# Altium project omni robot main board.PrjPcb
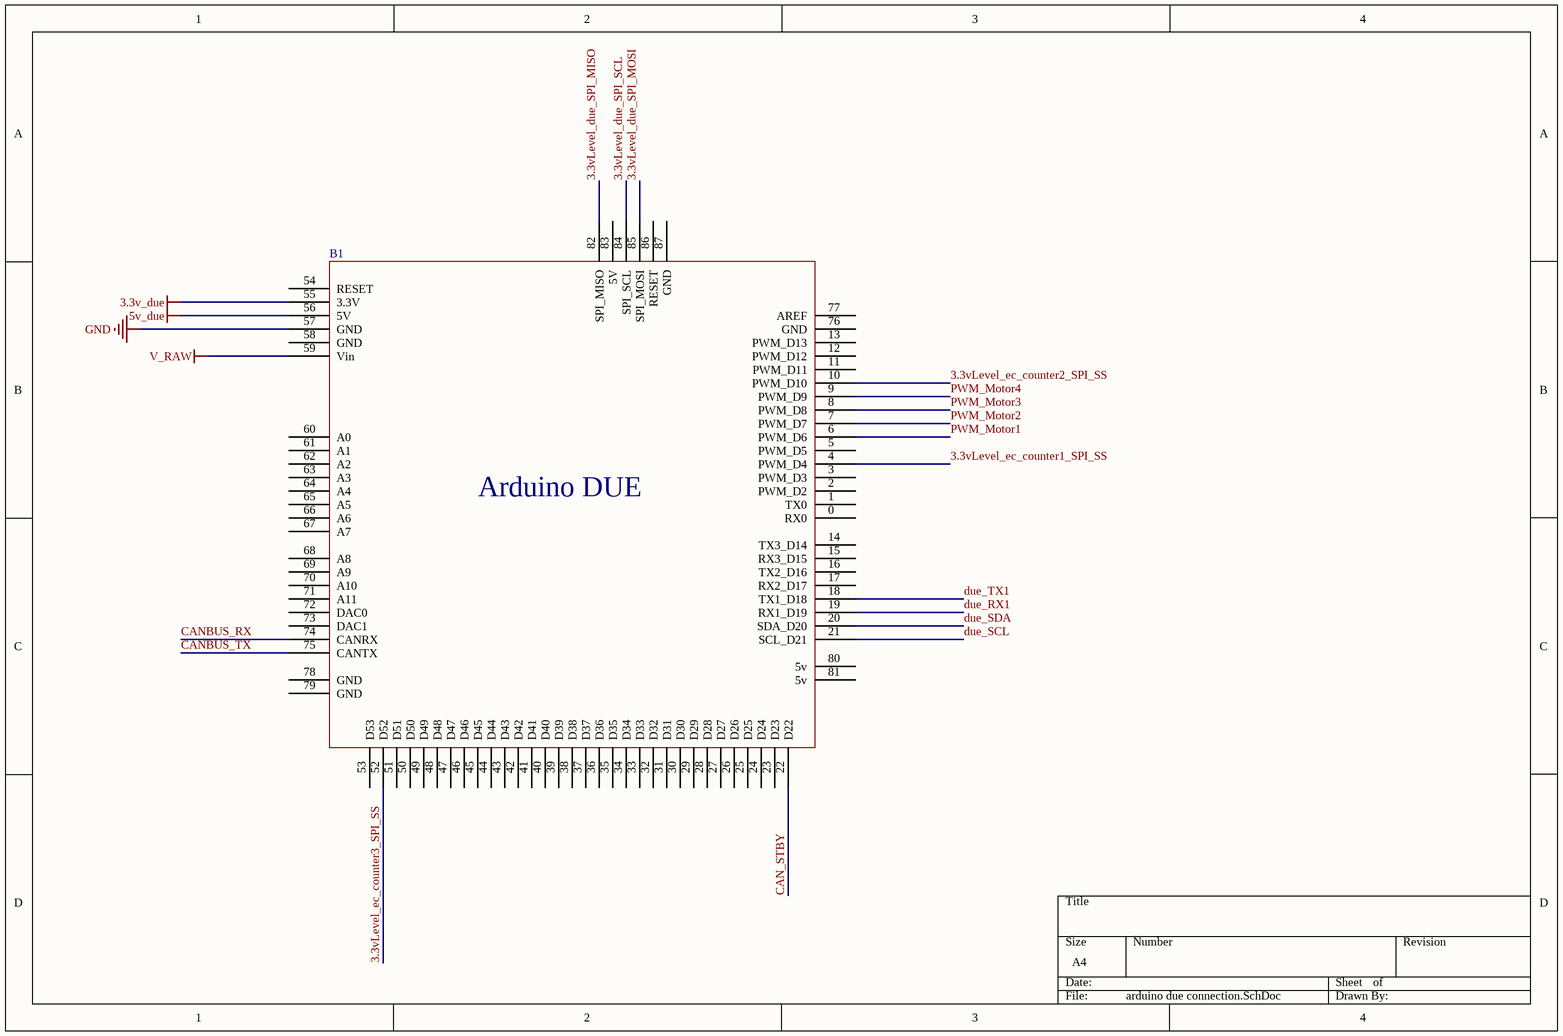
[diagram p0: arduino due connection.SchDoc]
4 sheets, 26 parts. Net scope: global (net labels, ports and power ports of the same name join across sheets).
Board file: omni robot pcb.PcbDoc
Sheets:
  arduino due connection.SchDoc
  arduino due component connection.SchDoc
  outgoing connection.SchDoc
  arduino due component connection 2.SchDoc

## Sheet arduino due connection.SchDoc
size A4

### Parts
B1  arduino due  [PCBComponent_1]  (value not drawn)

### Nets
3.3v_due: B1.55(3.3V)
5v_due: B1.56(5V)
GND: B1.57(GND)
V_RAW: B1.59(Vin)
3.3vLevel_due_SPI_MISO: B1.82(SPI_MISO)
3.3vLevel_due_SPI_MOSI: B1.85(SPI_MOSI)
3.3vLevel_due_SPI_SCL: B1.84(SPI_SCL)
3.3vLevel_ec_counter1_SPI_SS: B1.4(PWM_D4)
3.3vLevel_ec_counter2_SPI_SS: B1.10(PWM_D10)
3.3vLevel_ec_counter3_SPI_SS: B1.52(D52)
CAN_STBY: B1.22(D22)
CANBUS_RX: B1.74(CANRX)
CANBUS_TX: B1.75(CANTX)
due_RX1: B1.19(RX1_D19)
due_SCL: B1.21(SCL_D21)
due_SDA: B1.20(SDA_D20)
due_TX1: B1.18(TX1_D18)
PWM_Motor1: B1.6(PWM_D6)
PWM_Motor2: B1.7(PWM_D7)
PWM_Motor3: B1.8(PWM_D8)
PWM_Motor4: B1.9(PWM_D9)

Not connected (* = marked no-connect by the designer): B1 0(RX0) 1(TX0) 2(PWM_D2) 3(PWM_D3) 5(PWM_D5) 11(PWM_D11) 12(PWM_D12) 13(PWM_D13) 14(TX3_D14) 15(RX3_D15) 16(TX2_D16) 17(RX2_D17) 23(D23) 24(D24) 25(D25) 26(D26) 27(D27) 28(D28) 29(D29) 30(D30) 31(D31) 32(D32) 33(D33) 34(D34) 35(D35) 36(D36) 37(D37) 38(D38) 39(D39) 40(D40) 41(D41) 42(D42) 43(D43) 44(D44) 45(D45) 46(D46) 47(D47) 48(D48) 49(D49) 50(D50) 51(D51) 53(D53) 54(RESET) 58(GND) 60(A0) 61(A1) 62(A2) 63(A3) 64(A4) 65(A5) 66(A6) 67(A7) 68(A8) 69(A9) 70(A10) 71(A11) 72(DAC0) 73(DAC1) 76(GND) 77(AREF) 78(GND) 79(GND) 80(5v) 81(5v) 83(5V) 86(RESET) 87(GND)

### Notes on the sheet
- (in symbol arduino due) Arduino DUE

## Sheet arduino due component connection.SchDoc
size A4
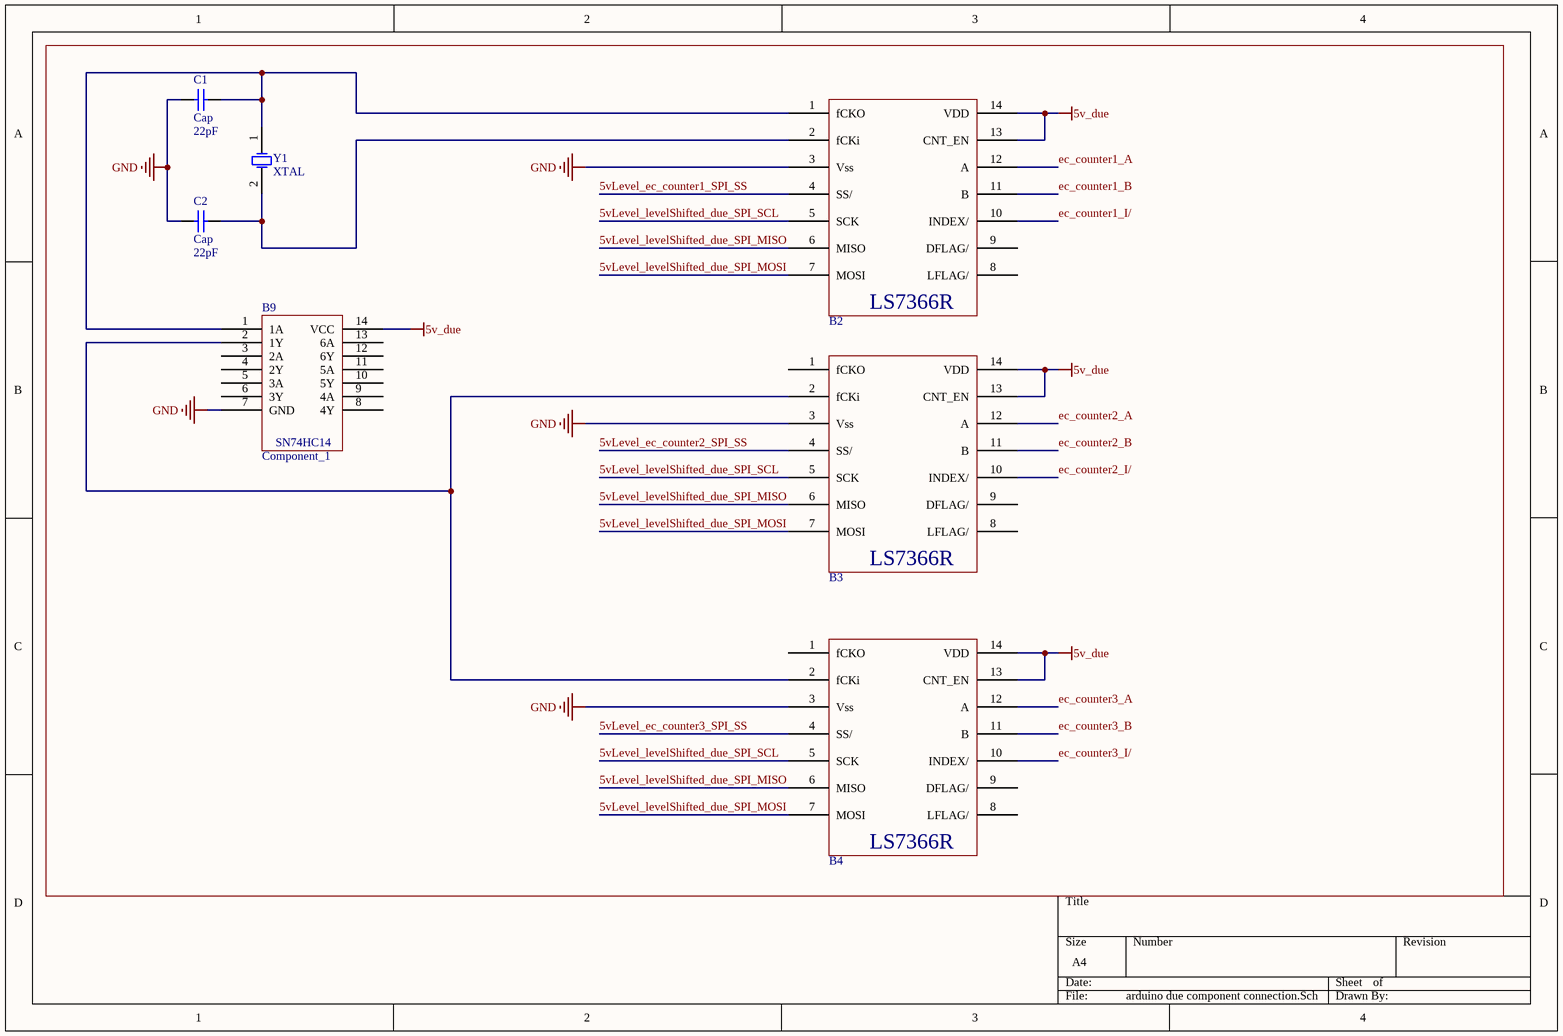
[diagram p1: arduino due component connection.SchDoc]

### Parts
B2  Component_1  [DIP-14]  (value not drawn)
B3  Component_1  [DIP-14]  (value not drawn)
B4  Component_1  [DIP-14]  (value not drawn)
B9  Component_1  [DIP-14]
C1  Cap  value 22pF  [RAD-0.1]
C2  Cap  value 22pF  [RAD-0.1]
Y1  XTAL  [R38]

### Nets
5v_due: B2.13(CNT_EN) B2.14(VDD) B3.13(CNT_EN) B3.14(VDD) B4.13(CNT_EN) B4.14(VDD) B9.14(VCC)
GND: B2.3(Vss) B3.3(Vss) B4.3(Vss) B9.7(GND) C1.1 C2.1
5vLevel_ec_counter1_SPI_SS: B2.4(SS/)
5vLevel_ec_counter2_SPI_SS: B3.4(SS/)
5vLevel_ec_counter3_SPI_SS: B4.4(SS/)
5vLevel_levelShifted_due_SPI_MISO: B2.6(MISO) B3.6(MISO) B4.6(MISO)
5vLevel_levelShifted_due_SPI_MOSI: B2.7(MOSI) B3.7(MOSI) B4.7(MOSI)
5vLevel_levelShifted_due_SPI_SCL: B2.5(SCK) B3.5(SCK) B4.5(SCK)
ec_counter1_A: B2.12(A)
ec_counter1_B: B2.11(B)
ec_counter1_I/: B2.10(INDEX/)
ec_counter2_A: B3.12(A)
ec_counter2_B: B3.11(B)
ec_counter2_I/: B3.10(INDEX/)
ec_counter3_A: B4.12(A)
ec_counter3_B: B4.11(B)
ec_counter3_I/: B4.10(INDEX/)
NetB2_1: B2.1(fCKO) B9.1(1A) C1.2 Y1.1(OSC1)
NetB2_2: B2.2(fCKi) C2.2 Y1.2(OSC2)
NetB3_2: B3.2(fCKi) B4.2(fCKi) B9.2(1Y)

Not connected (* = marked no-connect by the designer): B2 8(LFLAG/) 9(DFLAG/); B3 1(fCKO) 8(LFLAG/) 9(DFLAG/); B4 1(fCKO) 8(LFLAG/) 9(DFLAG/); B9 3(2A) 4(2Y) 5(3A) 6(3Y) 8(4Y) 9(4A) 10(5Y) 11(5A) 12(6Y) 13(6A)

### Notes on the sheet
- Encoder Counters
- (in symbol Component_1) LS7366R; SN74HC14

### Library data of the parts
C1 C2 = Cap: Capacitor; Published: 8-Jun-2000; LatestRevisionDate: 17-Jul-2002; LatestRevisionNote: Re-released for DXP Platform.; PackageReference: RAD-0.3; Publisher: Altium Limited; PackageDescription: Radial Cap, Thru-Hole; 2 Leads; 0.3 in Pin Spacing
Y1 = XTAL: Crystal Oscillator; Published: 8-Jun-2000; LatestRevisionDate: 17-Jul-2002; LatestRevisionNote: Re-released for DXP Platform.; PackageReference: R38; Publisher: Altium Limited; PackageDescription: Crystal, Thru-Hole; 2 Leads; Body 3.1 x 8.2 mm (Dia.xH)

## Sheet outgoing connection.SchDoc
size A4
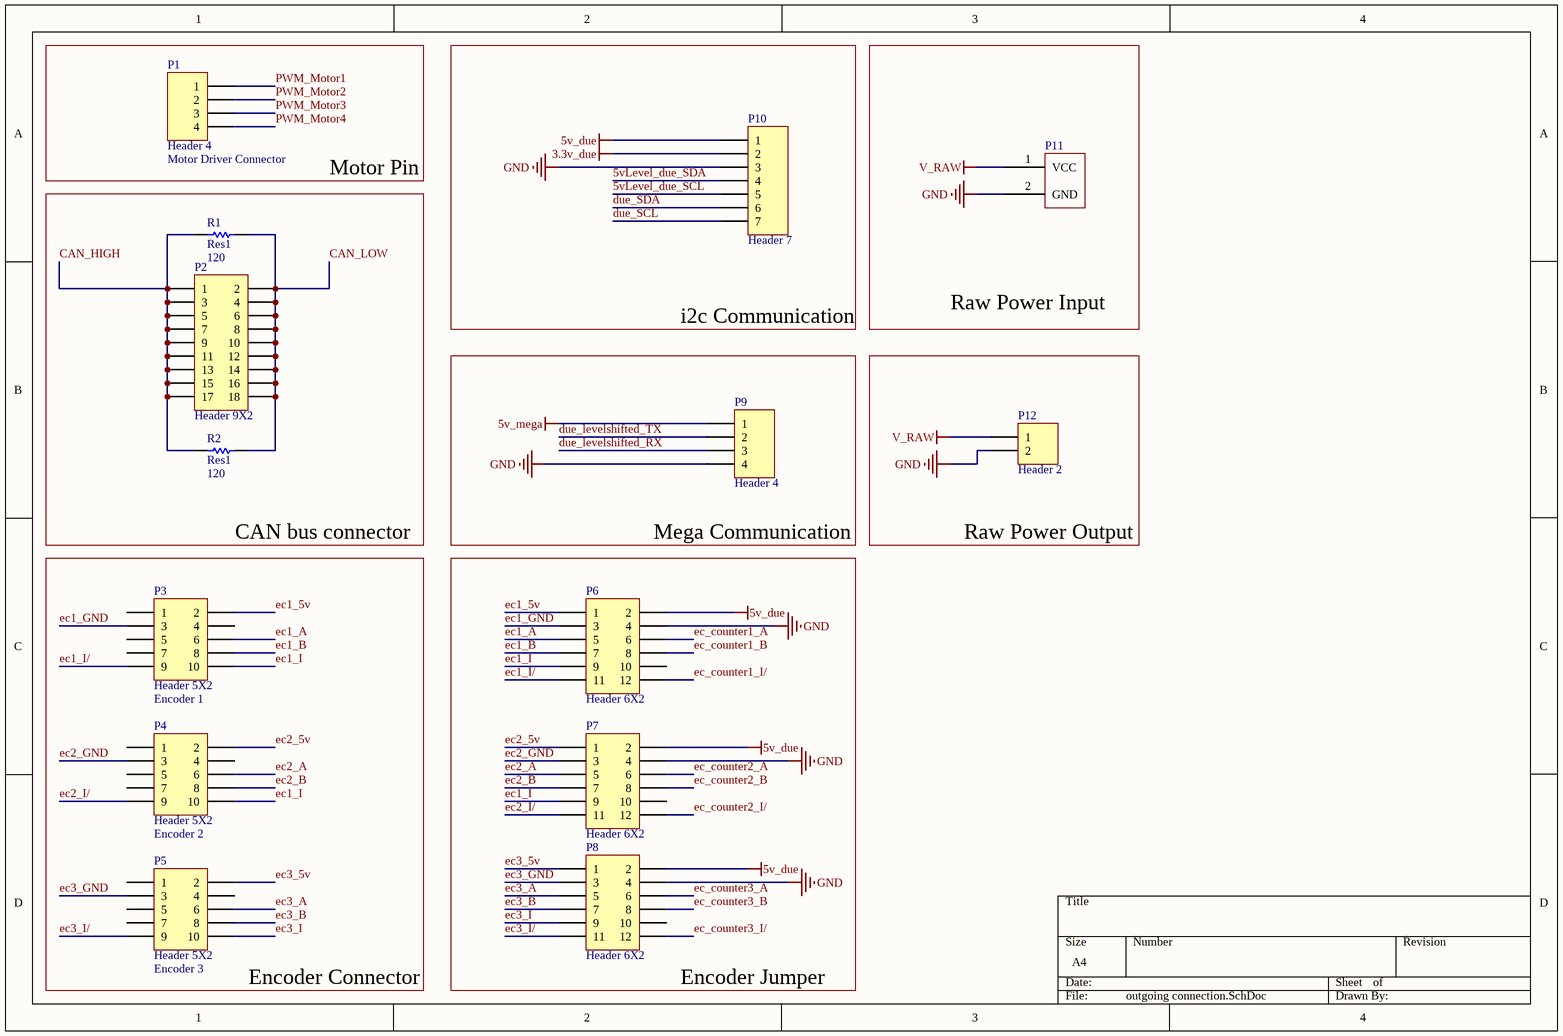
[diagram p2: outgoing connection.SchDoc]

### Parts
P1  Header 4  Usage: Motor Driver Connector  [HDR1X4]
P2  Header 9X2  [HDR2X9]
P3  Header 5X2  Usage: Encoder 1  [HDR2X5]
P4  Header 5X2  Usage: Encoder 2  [HDR2X5]
P5  Header 5X2  Usage: Encoder 3  [HDR2X5]
P6  Header 6X2  [HDR2X6]
P7  Header 6X2  [HDR2X6]
P8  Header 6X2  [HDR2X6]
P9  Header 4  [HDR1X4]
P10  Header 7  [HDR1X7]
P11  big Pin power port  [bigPin_power_port]  (value not drawn)
P12  Header 2  [HDR1X2]
R1  Res1  value 120  [AXIAL-0.3]
R2  Res1  value 120  [AXIAL-0.3]

### Nets
3.3v_due: P10.2
5v_due: P6.2 P7.2 P8.2 P10.1
5v_mega: P9.1
GND: P6.4 P7.4 P8.4 P9.4 P10.3 P11.2(GND) P12.2
V_RAW: P11.1(VCC) P12.1
5vLevel_due_SCL: P10.5
5vLevel_due_SDA: P10.4
CAN_HIGH: P2.1 P2.3 P2.5 P2.7 P2.9 P2.11 P2.13 P2.15 P2.17 R1.1 R2.1
CAN_LOW: P2.2 P2.4 P2.6 P2.8 P2.10 P2.12 P2.14 P2.16 P2.18 R1.2 R2.2
due_levelshifted_RX: P9.3
due_levelshifted_TX: P9.2
due_SCL: P10.7
due_SDA: P10.6
ec1_5v: P3.2 P6.1
ec1_A: P3.6 P6.5
ec1_B: P3.8 P6.7
ec1_GND: P3.3 P6.3
ec1_I: P3.10 P4.10 P6.9 P7.9
ec1_I/: P3.9 P6.11
ec2_5v: P4.2 P7.1
ec2_A: P4.6 P7.5
ec2_B: P4.8 P7.7
ec2_GND: P4.3 P7.3
ec2_I/: P4.9 P7.11
ec3_5v: P5.2 P8.1
ec3_A: P5.6 P8.5
ec3_B: P5.8 P8.7
ec3_GND: P5.3 P8.3
ec3_I: P5.10 P8.9
ec3_I/: P5.9 P8.11
ec_counter1_A: P6.6
ec_counter1_B: P6.8
ec_counter1_I/: P6.12
ec_counter2_A: P7.6
ec_counter2_B: P7.8
ec_counter2_I/: P7.12
ec_counter3_A: P8.6
ec_counter3_B: P8.8
ec_counter3_I/: P8.12
PWM_Motor1: P1.1
PWM_Motor2: P1.2
PWM_Motor3: P1.3
PWM_Motor4: P1.4

Not connected (* = marked no-connect by the designer): P3 1 4 5 7; P4 1 4 5 7; P5 1 4 5 7; P6 10; P7 10; P8 10

### Notes on the sheet
- Motor Pin
- Raw Power Input
- i2c Communication
- CAN bus connector
- Mega Communication
- Raw Power Output
- (near P5) Encoder Connector
- (near P8) Encoder Jumper

### Library data of the parts
P1 P9 = Header 4: Header, 4-Pin; LatestRevisionDate: 17-Jul-2002; LatestRevisionNote: Re-released for DXP Platform.; Publisher: Altium Limited
P2 = Header 9X2: Header, 9-Pin, Dual row; LatestRevisionDate: 17-Jul-2002; LatestRevisionNote: Re-released for DXP Platform.; Publisher: Altium Limited
P3-P5 = Header 5X2: Header, 5-Pin, Dual row; LatestRevisionDate: 17-Jul-2002; LatestRevisionNote: Re-released for DXP Platform.; Publisher: Altium Limited
P6-P8 = Header 6X2: Header, 6-Pin, Dual row; LatestRevisionDate: 17-Jul-2002; LatestRevisionNote: Re-released for DXP Platform.; Publisher: Altium Limited
P10 = Header 7: Header, 7-Pin; LatestRevisionDate: 17-Jul-2002; LatestRevisionNote: Re-released for DXP Platform.; Publisher: Altium Limited
P12 = Header 2: Header, 2-Pin; LatestRevisionDate: 17-Jul-2002; LatestRevisionNote: Re-released for DXP Platform.; Publisher: Altium Limited
R1 R2 = Res1: Resistor; Published: 8-Jun-2000; LatestRevisionDate: 17-Jul-2002; LatestRevisionNote: Re-released for DXP Platform.; PackageReference: AXIAL-0.3; Publisher: Altium Limited; PackageDescription: Axial Device, Thru-Hole; 2 Leads; 0.3 in Pin Spacing

## Sheet arduino due component connection 2.SchDoc
size A4
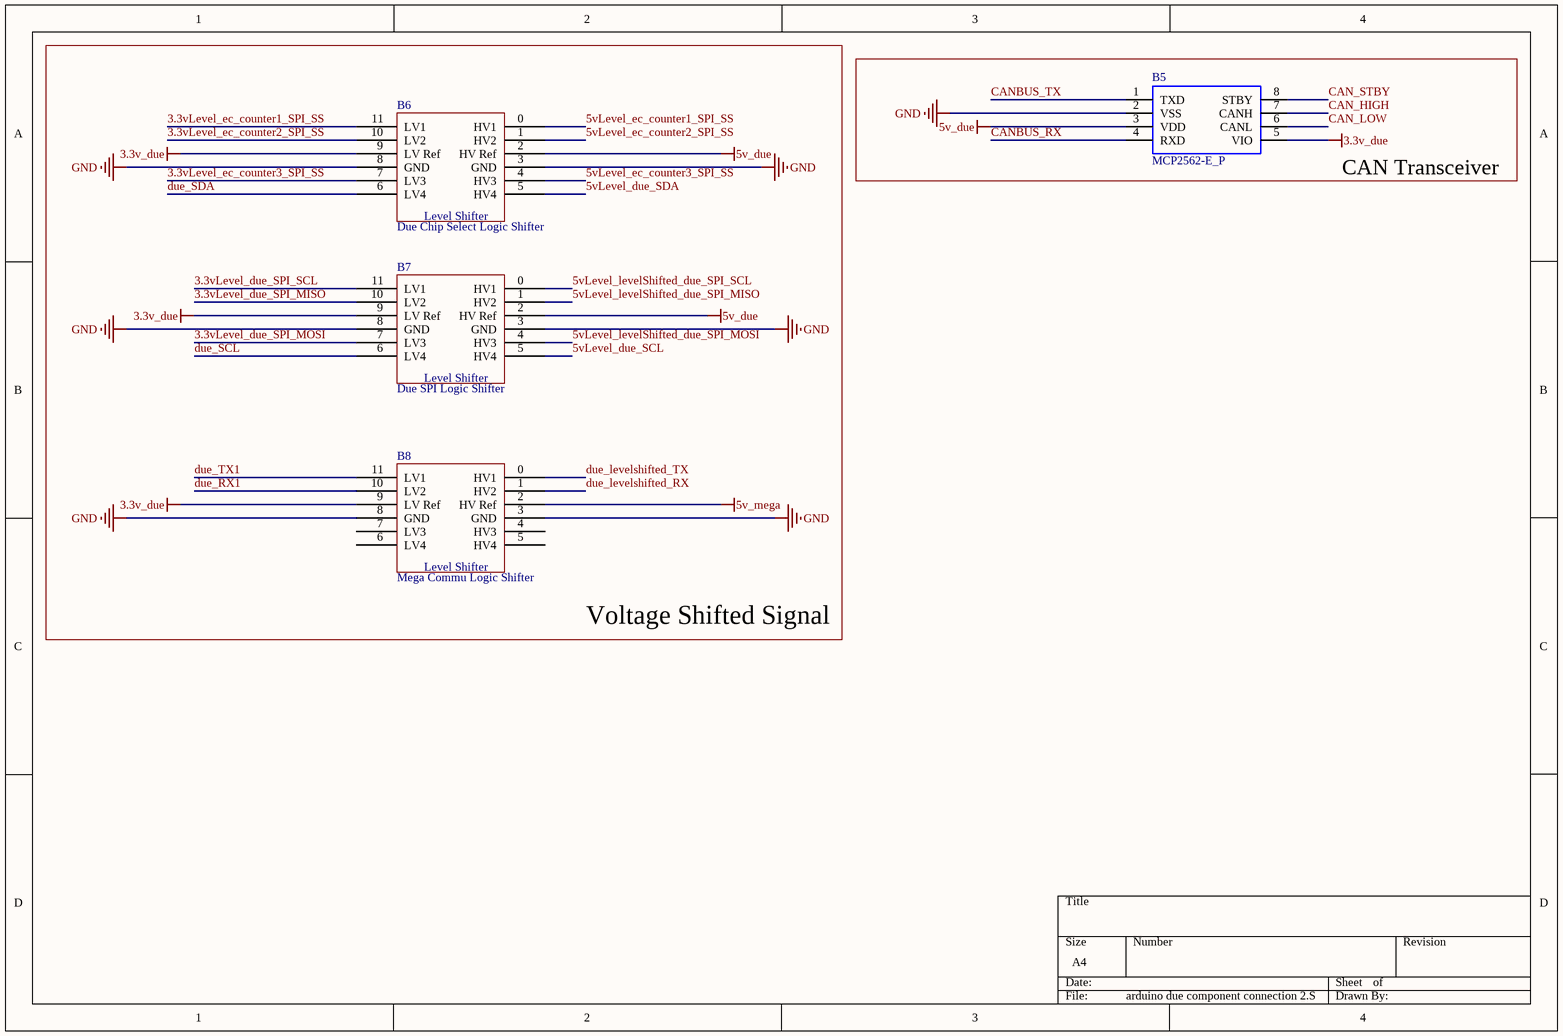
[diagram p3: arduino due component connection 2.SchDoc]

### Parts
B5  MCP2562-E_P  [DIP781W56P254L950H533Q8N]
B6  usage: Due Chip Select Logic Shifter  [level shifter 4C]  (hidden comment: Level Shifter 4 Channel)
B7  usage: Due SPI Logic Shifter  [level shifter 4C]  (hidden comment: Level Shifter 4 Channel)
B8  usage: Mega Commu Logic Shifter  [level shifter 4C]  (hidden comment: Level Shifter 4 Channel)

### Nets
3.3v_due: B5.5(VIO) B6.9(LV_Ref) B7.9(LV_Ref) B8.9(LV_Ref)
5v_due: B5.3(VDD) B6.2(HV_Ref) B7.2(HV_Ref)
5v_mega: B8.2(HV_Ref)
GND: B5.2(VSS) B6.3(GND) B6.8(GND) B7.3(GND) B7.8(GND) B8.3(GND) B8.8(GND)
3.3vLevel_due_SPI_MISO: B7.10(LV2)
3.3vLevel_due_SPI_MOSI: B7.7(LV3)
3.3vLevel_due_SPI_SCL: B7.11(LV1)
3.3vLevel_ec_counter1_SPI_SS: B6.11(LV1)
3.3vLevel_ec_counter2_SPI_SS: B6.10(LV2)
3.3vLevel_ec_counter3_SPI_SS: B6.7(LV3)
5vLevel_due_SCL: B7.5(HV4)
5vLevel_due_SDA: B6.5(HV4)
5vLevel_ec_counter1_SPI_SS: B6.0(HV1)
5vLevel_ec_counter2_SPI_SS: B6.1(HV2)
5vLevel_ec_counter3_SPI_SS: B6.4(HV3)
5vLevel_levelShifted_due_SPI_MISO: B7.1(HV2)
5vLevel_levelShifted_due_SPI_MOSI: B7.4(HV3)
5vLevel_levelShifted_due_SPI_SCL: B7.0(HV1)
CAN_HIGH: B5.7(CANH)
CAN_LOW: B5.6(CANL)
CAN_STBY: B5.8(STBY)
CANBUS_RX: B5.4(RXD)
CANBUS_TX: B5.1(TXD)
due_levelshifted_RX: B8.1(HV2)
due_levelshifted_TX: B8.0(HV1)
due_RX1: B8.10(LV2)
due_SCL: B7.6(LV4)
due_SDA: B6.6(LV4)
due_TX1: B8.11(LV1)

Not connected (* = marked no-connect by the designer): B8 4(HV3) 5(HV4) 6(LV4) 7(LV3)

### Notes on the sheet
- CAN Transceiver
- Voltage Shifted Signal
- (in symbol Level Shifter 4 Channel) Level Shifter

### Library data of the parts
B5 = MCP2562-E_P: CAN Transceiver 1Mbps 5V 125degC PDIP8 Microchip MCP2562-E/P, CAN Transceiver 1-channel IEC 61000-4-2, 8-Pin PDIP; Geometry.Height: 5.334mm; Supplier_Name: RS; RS Part Number: 7990225; Manufacturer_Name: Microchip; Manufacturer_Part_Number: MCP2562-E/P; Allied_Number: *; Other Part Number: *; Datasheet Link: http://uk.rs-online.com/webdocs/1380/0900766b81380aaf.pdf; 3D Package: *

## Nets that join several sheets
3.3v_due: arduino due connection (B1.55), outgoing connection (P10.2), arduino due component connection 2 (B5.5 B6.9 B7.9 B8.9)
5v_due: arduino due connection (B1.56), arduino due component connection (7 pins), outgoing connection (P6.2 P7.2 P8.2 P10.1), arduino due component connection 2 (B5.3 B6.2 B7.2)
5v_mega: outgoing connection (P9.1), arduino due component connection 2 (B8.2)
GND: arduino due connection (B1.57), arduino due component connection (6 pins), outgoing connection (7 pins), arduino due component connection 2 (7 pins)
V_RAW: arduino due connection (B1.59), outgoing connection (P11.1 P12.1)
3.3vLevel_due_SPI_MISO: arduino due connection (B1.82), arduino due component connection 2 (B7.10)
3.3vLevel_due_SPI_MOSI: arduino due connection (B1.85), arduino due component connection 2 (B7.7)
3.3vLevel_due_SPI_SCL: arduino due connection (B1.84), arduino due component connection 2 (B7.11)
3.3vLevel_ec_counter1_SPI_SS: arduino due connection (B1.4), arduino due component connection 2 (B6.11)
3.3vLevel_ec_counter2_SPI_SS: arduino due connection (B1.10), arduino due component connection 2 (B6.10)
3.3vLevel_ec_counter3_SPI_SS: arduino due connection (B1.52), arduino due component connection 2 (B6.7)
5vLevel_due_SCL: outgoing connection (P10.5), arduino due component connection 2 (B7.5)
5vLevel_due_SDA: outgoing connection (P10.4), arduino due component connection 2 (B6.5)
5vLevel_ec_counter1_SPI_SS: arduino due component connection (B2.4), arduino due component connection 2 (B6.0)
5vLevel_ec_counter2_SPI_SS: arduino due component connection (B3.4), arduino due component connection 2 (B6.1)
5vLevel_ec_counter3_SPI_SS: arduino due component connection (B4.4), arduino due component connection 2 (B6.4)
5vLevel_levelShifted_due_SPI_MISO: arduino due component connection (B2.6 B3.6 B4.6), arduino due component connection 2 (B7.1)
5vLevel_levelShifted_due_SPI_MOSI: arduino due component connection (B2.7 B3.7 B4.7), arduino due component connection 2 (B7.4)
5vLevel_levelShifted_due_SPI_SCL: arduino due component connection (B2.5 B3.5 B4.5), arduino due component connection 2 (B7.0)
CAN_HIGH: outgoing connection (11 pins), arduino due component connection 2 (B5.7)
CAN_LOW: outgoing connection (11 pins), arduino due component connection 2 (B5.6)
CAN_STBY: arduino due connection (B1.22), arduino due component connection 2 (B5.8)
CANBUS_RX: arduino due connection (B1.74), arduino due component connection 2 (B5.4)
CANBUS_TX: arduino due connection (B1.75), arduino due component connection 2 (B5.1)
due_levelshifted_RX: outgoing connection (P9.3), arduino due component connection 2 (B8.1)
due_levelshifted_TX: outgoing connection (P9.2), arduino due component connection 2 (B8.0)
due_RX1: arduino due connection (B1.19), arduino due component connection 2 (B8.10)
due_SCL: arduino due connection (B1.21), outgoing connection (P10.7), arduino due component connection 2 (B7.6)
due_SDA: arduino due connection (B1.20), outgoing connection (P10.6), arduino due component connection 2 (B6.6)
due_TX1: arduino due connection (B1.18), arduino due component connection 2 (B8.11)
ec_counter1_A: arduino due component connection (B2.12), outgoing connection (P6.6)
ec_counter1_B: arduino due component connection (B2.11), outgoing connection (P6.8)
ec_counter1_I/: arduino due component connection (B2.10), outgoing connection (P6.12)
ec_counter2_A: arduino due component connection (B3.12), outgoing connection (P7.6)
ec_counter2_B: arduino due component connection (B3.11), outgoing connection (P7.8)
ec_counter2_I/: arduino due component connection (B3.10), outgoing connection (P7.12)
ec_counter3_A: arduino due component connection (B4.12), outgoing connection (P8.6)
ec_counter3_B: arduino due component connection (B4.11), outgoing connection (P8.8)
ec_counter3_I/: arduino due component connection (B4.10), outgoing connection (P8.12)
PWM_Motor1: arduino due connection (B1.6), outgoing connection (P1.1)
PWM_Motor2: arduino due connection (B1.7), outgoing connection (P1.2)
PWM_Motor3: arduino due connection (B1.8), outgoing connection (P1.3)
PWM_Motor4: arduino due connection (B1.9), outgoing connection (P1.4)